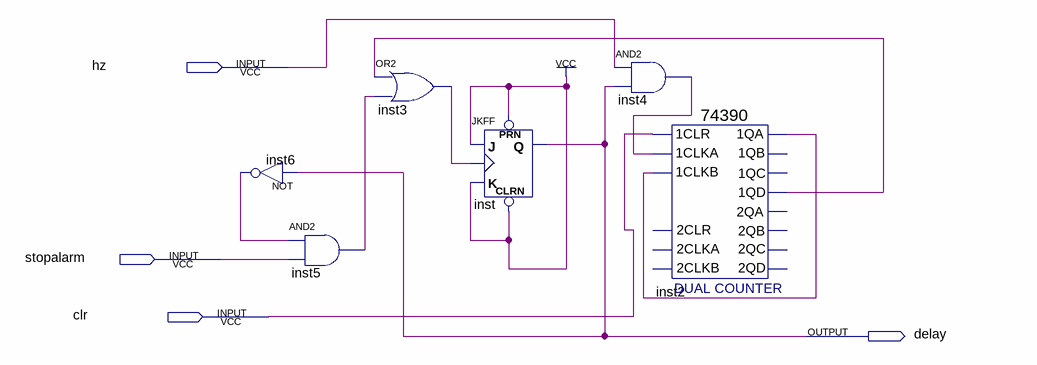
[diagram p0: schematic sheet]
// Quartus schematic boom.bdf as structural Verilog: 6 symbols, 4 pins
module boom (
  input  hz,
  input  stopalarm,
  input  clr,
  output delay
);

  wire inst2_1qa, inst2_1qd, inst3_out, inst4_out, inst5_out, inst6_out;

  not inst6 (inst6_out, delay);
  and inst5 (inst5_out, inst6_out, stopalarm);
  or inst3 (inst3_out, inst2_1qd, inst5_out);
  JKFF inst (.PRN(1'b1), .CLRN(1'b1), .K(1'b1), .J(1'b1), .CLK(inst3_out), .Q(delay));
  and inst4 (inst4_out, hz, delay);
  \74390  inst2 (
    .\1CLR (clr), .\1CLKA (inst4_out), .\1CLKB (inst2_1qa), .\1QA (inst2_1qa), .\1QD (inst2_1qd));  // open: 2CLKA, 2CLR, 2CLKB, 1QB, 1QC, 2QA, 2QB, 2QC, 2QD
endmodule
